# EAGLE schematic power_GND (EAGLE 9.3.2)
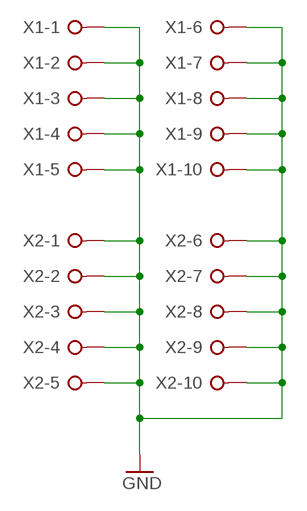
[diagram p0: schematic, sheet 1]

## Parts
X1  W237-10P  [W237-10P]
X2  W237-10P  [W237-10P]

## Nets
GND: X1.1 X1.2 X1.3 X1.4 X1.5 X1.6 X1.7 X1.8 X1.9 X1.10 X2.1 X2.2 X2.3 X2.4 X2.5 X2.6 X2.7 X2.8 X2.9 X2.10

## Library data of the parts
X1 X2 = con-wago-508:W237-10P: WAGO SREW CLAMP; OC_FARNELL: unknown; OC_NEWARK: unknown